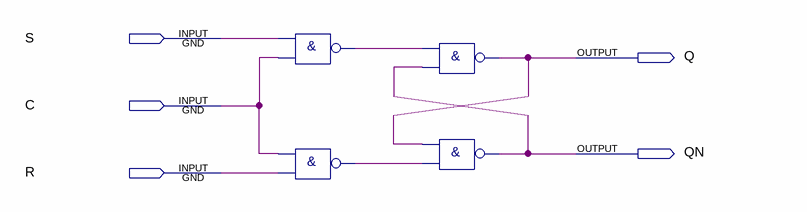
[diagram p0: schematic sheet]
// Quartus schematic RST_FF.bdf as structural Verilog: 4 symbols, 5 pins
module RST_FF (
  input  S,
  input  C,
  input  R,
  output Q,
  output QN
);

  wire inst3_out, inst4_out;

  nand inst3 (inst3_out, S, C);
  nand inst4 (inst4_out, C, R);
  nand inst6 (Q, inst3_out, QN);
  nand inst5 (QN, Q, inst4_out);
endmodule
